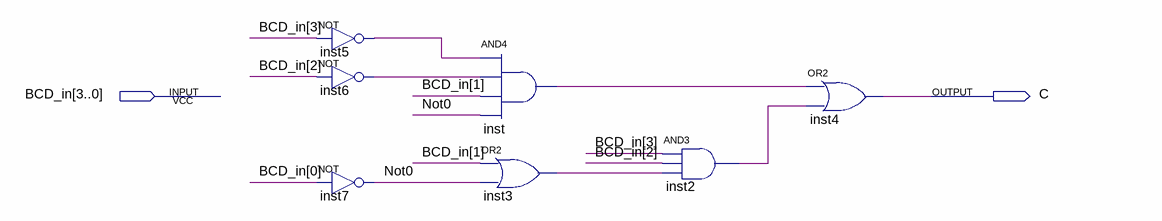
[diagram p0: schematic sheet]
// Quartus schematic BCD_C.bdf as structural Verilog: 7 symbols, 2 pins
module BCD_C (
  input  [3:0] BCD_in,
  output C
);

  wire inst2_out, inst3_out, inst5_out, inst6_out, inst_out, Not0;

  not inst5 (inst5_out, BCD_in[3]);
  not inst6 (inst6_out, BCD_in[2]);
  not inst7 (Not0, BCD_in[0]);
  and inst (inst_out, inst5_out, inst6_out, BCD_in[1], Not0);
  or inst3 (inst3_out, BCD_in[1], Not0);
  and inst2 (inst2_out, BCD_in[3], BCD_in[2], inst3_out);
  or inst4 (C, inst_out, inst2_out);
endmodule
